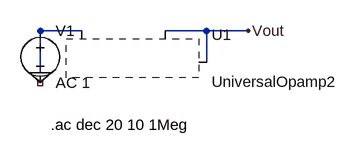
[diagram p0: schematic opamp_buffer.asc]
opamp_buffer.asc, the LTspice schematic file:
Version 4
SHEET 1 880 680
WIRE 128 112 64 112
WIRE 320 112 256 112
WIRE 384 112 320 112
WIRE 320 160 320 112
WIRE 64 176 64 112
FLAG 64 176 0
FLAG 384 112 Vout
SYMBOL voltage 64 96 R0
SYMATTR InstName V1
SYMATTR Value AC 1
SYMBOL UniversalOpamp2 256 112 R0
SYMATTR InstName U1
SYMATTR Value UniversalOpamp2
TEXT 80 256 Left 2 !.ac dec 20 10 1Meg

The netlist it stands for:
* opamp_buffer.asc
V1 0 NC_01 AC 1
* U1: UniversalOpamp2 (symbol UniversalOpamp2 not available, pin order unknown); nets seen at it: 0, Vout
.ac dec 20 10 1Meg
.backanno
.end